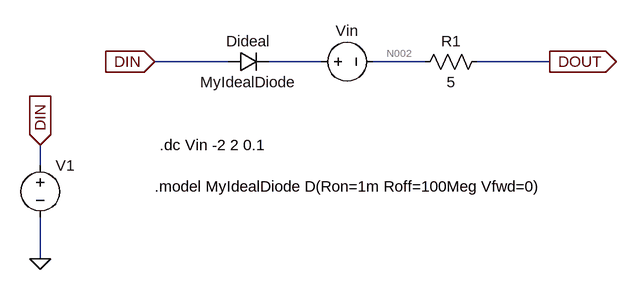
[diagram p0: schematic Lab 4 - Sec A #2.asc]
Lab 4 - Sec A #2.asc, the LTspice schematic file:
Version 4
SHEET 1 880 680
WIRE 32 160 -80 160
WIRE 176 160 96 160
WIRE 336 160 256 160
WIRE 528 160 416 160
WIRE -256 320 -256 288
WIRE -256 464 -256 400
FLAG -80 160 DIN
IOPIN -80 160 In
FLAG 528 160 DOUT
IOPIN 528 160 Out
FLAG -256 464 0
FLAG -256 288 DIN
IOPIN -256 288 In
SYMBOL diode 32 176 R270
WINDOW 0 32 32 VTop 2
WINDOW 3 0 32 VBottom 2
SYMATTR InstName Dideal
SYMATTR Value MyIdealDiode
SYMBOL voltage 160 160 R270
WINDOW 0 32 56 VTop 2
WINDOW 3 -32 56 VBottom 2
SYMATTR InstName Vin
SYMATTR Value ""
SYMBOL res 432 144 R90
WINDOW 0 0 56 VBottom 2
WINDOW 3 32 56 VTop 2
SYMATTR InstName R1
SYMATTR Value 5
SYMBOL voltage -256 304 R0
SYMATTR InstName V1
SYMATTR Value ""
TEXT -72 288 Left 2 !.dc Vin -2 2 0.1
TEXT -80 352 Left 2 !.model MyIdealDiode D(Ron=1m Roff=100Meg Vfwd=0)

The netlist it stands for:
* Lab 4 - Sec A #2.asc
Dideal DIN N001 MyIdealDiode
Vin N001 N002
R1 DOUT N002 5
V1 DIN 0
.model D D
.lib standard.dio
.dc Vin -2 2 0.1
.model MyIdealDiode D(Ron=1m Roff=100Meg Vfwd=0)
.backanno
.end

* Results of the author's LTspice run, read from the files saved beside the schematic
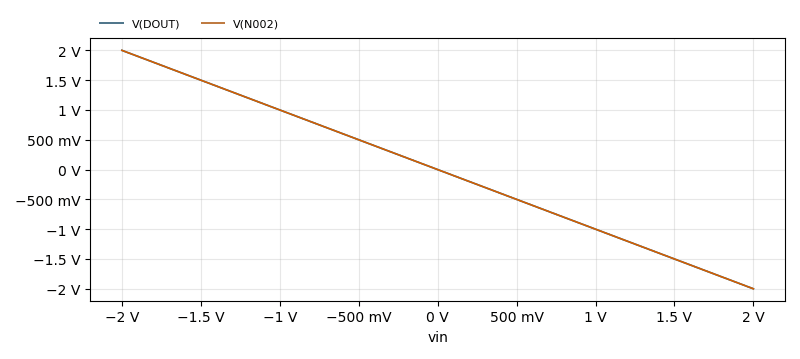
[diagram p1: DC transfer characteristic of Lab 4 - Sec A #2.asc, plotted from the saved traces]
* DC transfer characteristic, 1 run:
*   V(DOUT): 2 V at vin=-2 V, -2 V at vin=2 V, min -2 V, max 2 V
*   V(N002): 2 V at vin=-2 V, -2 V at vin=2 V, min -2 V, max 2 V